# EAGLE schematic RSeries VCSensor v1.2 (EAGLE 6.4)
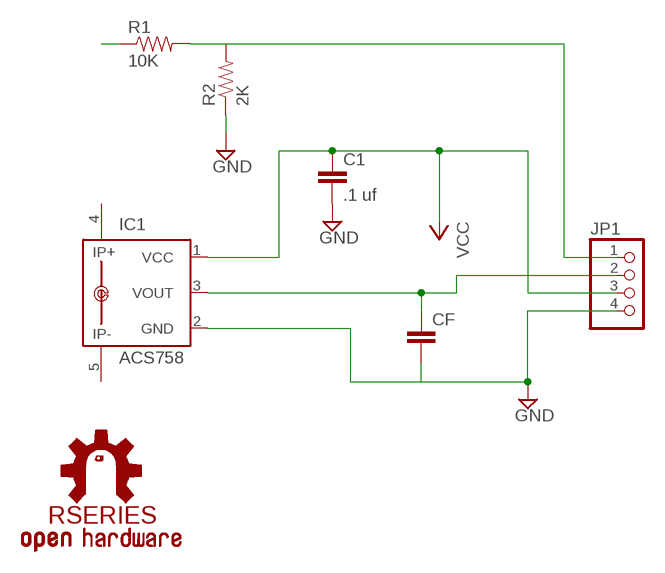
[diagram p0: schematic, sheet 1]

## Parts
C1  .1 uf  CAPPTH  [CAP-PTH-SMALL]
CF  CAPPTH1  [CAP-PTH-5MM]
IC1  ACS758  ACS758LCB-050B-PFF-T  [CB-PFF]
JP1  PINHD-1X4  [1X04]
R1  10K  RESISTORPTH-1/4W  [AXIAL-0.4]
R2  2K  RESISTORPTH-1/4W  [AXIAL-0.4]
U$1  RSERIES-OSHW-LOGO  [RSERIES-OSHW-LOGO-LARGE]

## Nets
GND: C1.2 CF.2 IC1.2(GND) JP1.4 R2.P$1
N$1: R1.P$1
N$2: CF.1 IC1.3(VOUT) JP1.2
N$3: JP1.1 R1.P$2 R2.P$2
VCC: C1.1 IC1.1(VCC) JP1.3
Unconnected: IC1.4(IP+) IC1.5(IP-) IC1.IP+1 IC1.IP-1

## Library data of the parts
C1 CF = SparkFun-Passives:CAP: Capacitor Standard 0603 ceramic capacitor, and 0.1" leaded capacitor.
IC1 = allegro:ACS758*: Thermally Enhanced, Fully Integrated, Hall Effect-Based Linear Current Sensor with 100 micro Ohm Current Conductor display layer 49 Reference in BRD and place VIAs on circles Source: http://www.allegromicro.com/en/Products/Part_Numbers/0758/0758.pdf; MPN: ACS758LCB-050B-PFF-T; OC_FARNELL: 1718997; OC_NEWARK: 04R7131
JP1 = pinhead:PINHD-1X4: PIN HEADER
R1 R2 = SparkFun-Passives:RESISTOR: Resistor Basic schematic elements and footprints for 0603, 1206, and PTH resistors.
U$1 = rseries:RSERIES-OSHW-LOGO